# Altium schematic sheet main_Schematic.SchDoc
size A4
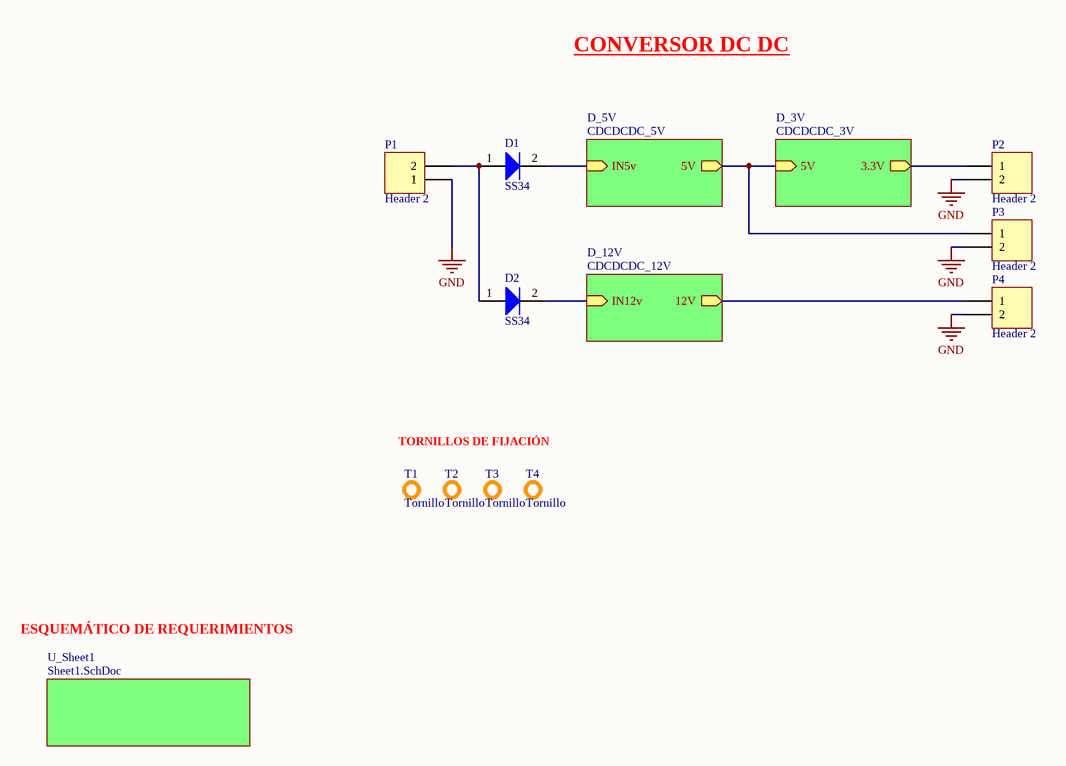
[diagram p0: main_Schematic.SchDoc]

## Parts
D1  SS34  [SMC]
D2  SS34  [SMC]
P1  Header 2  [HDR1X2]
P2  Header 2  [HDR1X2]
P3  Header 2  [HDR1X2]
P4  Header 2  [HDR1X2]
T1  Tornillo  [Tornilo - duplicate]
T2  Tornillo  [Tornilo - duplicate]
T3  Tornillo  [Tornilo - duplicate]
T4  Tornillo  [Tornilo - duplicate]

## Sub-sheets
D_3V = CDCDCDC_3V: 5V (in), 3.3V (out)
D_5V = CDCDCDC_5V: IN5v (in), 5V (out)
D_12V = CDCDCDC_12V: IN12v (in), 12V (out)
U_Sheet1 = Sheet1.SchDoc: no entries

## Nets
GND: P1.1 P2.2 P3.2 P4.2
NetD1_1: D1.1(A) D2.1(A) P1.2
NetD1_2: D1.2(K) ; sheet D_5V/IN5v
NetD2_2: D2.2(K) ; sheet D_12V/IN12v
NetP2_1: P2.1 ; sheet D_3V/3.3V
NetP3_1: P3.1 ; sheet D_5V/5V, sheet D_3V/5V
NetP4_1: P4.1 ; sheet D_12V/12V

## Notes on the sheet
- CONVERSOR DC DC
- TORNILLOS DE FIJACIÓN
- ESQUEMÁTICO DE REQUERIMIENTOS

## Library data of the parts
D1 D2 = Diode: Default Diode; Published: 8-Jun-2000; LatestRevisionDate: 17-Jul-2002; LatestRevisionNote: Re-released for DXP Platform.; PackageVersion: Sep-1996; PackageReference: SMC; Publisher: Altium Limited; PackageDescription: DO-214-AB/SMC; 2 C-Bend Leads; Body 7.9 x 5.9 mm, inc. leads (LxW); Code_JEDEC: DO-214-AB
P1-P4 = Header 2: Header, 2-Pin; LatestRevisionDate: 17-Jul-2002; LatestRevisionNote: Re-released for DXP Platform.; Publisher: Altium Limited